# EAGLE schematic baseboard (EAGLE 6.5.0)
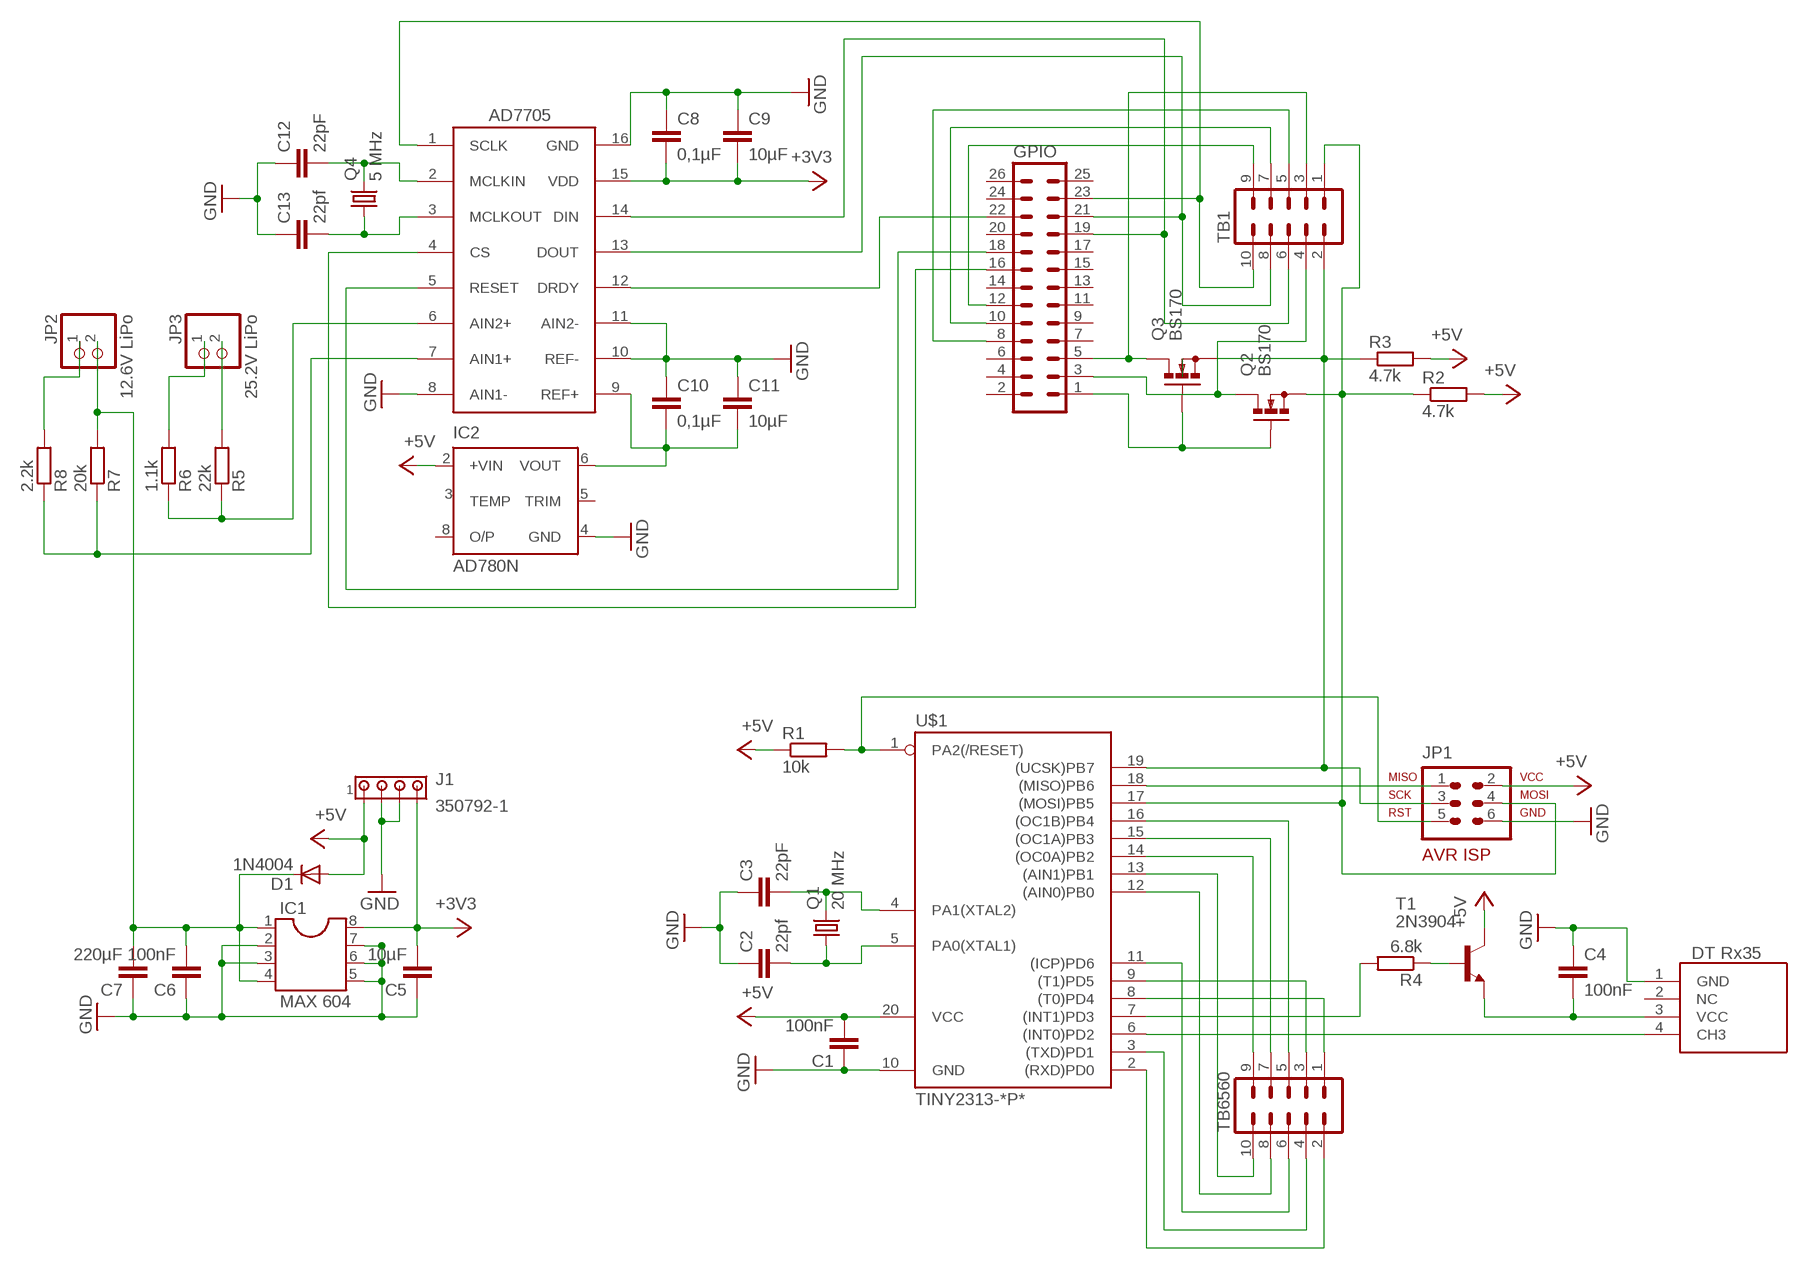
[diagram p0: schematic, sheet 1]

## Parts
C1  100nF  C2.5/2  [C2.5-2]
C2  22pf  C2.5/2  [C2.5-2]
C3  22pF  C2.5/2  [C2.5-2]
C4  100nF  C2.5/2  [C2.5-2]
C5  10µF  C2.5/2  [C2.5-2]
C6  100nF  C2.5/2  [C2.5-2]
C7  220µF  C2.5/2  [C2.5-2]
C8  0,1µF  C2.5/2  [C2.5-2]
C9  10µF  C2.5/2  [C2.5-2]
C10  0,1µF  C2.5/2  [C2.5-2]
C11  10µF  C2.5/2  [C2.5-2]
C12  22pF  C2.5/2  [C2.5-2]
C13  22pf  C2.5/2  [C2.5-2]
D1  1N4004  [DO41-10]
GPIO  ML26  [ML26]
IC1  MAX 604  DIL8  [DIL08]
IC2  AD780N  [DIL08]
J1  350792-1  [350792-1]
JP1  AVR-ISP-6VERT  [AVR-ISP-6]
JP2  12.6V LiPo  PINHD-1X2  [1X02]
JP3  25.2V LiPo  PINHD-1X2  [1X02]
Q1  20 MHz  CRYSTALHC49S  [HC49/S]
Q2  BS170  [SOT54E]
Q3  BS170  [SOT54E]
Q4  5 MHz  CRYSTALHC49S  [HC49/S]
R1  10k  R-EU_0207/2V  [0207/2V]
R2  4.7k  R-EU_0207/2V  [0207/2V]
R3  4.7k  R-EU_0207/2V  [0207/2V]
R4  6.8k  R-EU_0207/12  [0207/12]
R5  22k  R-EU_0207/2V  [0207/2V]
R6  1.1k  R-EU_0207/2V  [0207/2V]
R7  20k  R-EU_0207/2V  [0207/2V]
R8  2.2k  R-EU_0207/2V  [0207/2V]
T1  2N3904  [TO92]
TB1  ML10  [ML10]
TB6560  ML10  [ML10]
U$1  TINY2313-*P*  [DIL20]
U$2  DTRX35  [DTRX35]
U$3  AD7705  [AD7705BNC]

## Nets
+3V3: C5.2 C8.2 C9.2 IC1.8 J1.4 U$3.15(VDD)
+5V: C1.2 D1.A IC2.2(+VIN) J1.1 JP1.2 R1.1 R2.2 R3.2 T1.1(C) U$1.20(VCC)
GND: C1.1 C2.1 C3.1 C4.1 C5.1 C6.1 C7.1 C8.1 C9.1 C10.1 C11.1 C12.1 C13.1 IC1.2 IC1.3 IC1.5 IC1.6 IC1.7 IC2.4(GND) J1.2 J1.3 JP1.6 U$1.10(GND) U$2.1(GND) U$3.8(AIN1-) U$3.10(REF-) U$3.11(AIN2-) U$3.16(GND)
N$1: JP1.1 U$1.18((MISO)PB6)
N$2: GPIO.5 Q3.D TB1.3
N$4: GPIO.3 Q2.D TB1.4
N$5: GPIO.1 Q2.G Q3.G
N$6: TB6560.1 U$1.8((T0)PD4)
N$7: TB6560.3 U$1.9((T1)PD5)
N$8: TB6560.5 U$1.16((OC1B)PB4)
N$9: TB6560.7 U$1.15((OC1A)PB3)
N$10: TB6560.9 U$1.14((OC0A)PB2)
N$11: TB6560.10 U$1.13((AIN1)PB1)
N$12: TB6560.8 U$1.12((AIN0)PB0)
N$13: TB6560.6 U$1.11((ICP)PD6)
N$14: TB6560.4 U$1.3((TXD)PD1)
N$15: R4.1 T1.2(B)
N$16: JP1.4 Q2.S R2.1 TB1.1 U$1.17((MOSI)PB5)
N$17: C4.2 T1.3(E) U$2.3(VCC)
N$18: R4.2 U$1.7((INT1)PD3)
N$19: C3.2 Q1.2 U$1.4(PA1(XTAL2))
N$20: C2.2 Q1.1 U$1.5(PA0(XTAL1))
N$21: JP1.5 R1.2 U$1.1(PA2(/RESET))
N$22: U$1.6((INT0)PD2) U$2.4(CH3)
N$23: TB6560.2 U$1.2((RXD)PD0)
N$24: GPIO.12 TB1.9
N$25: GPIO.10 TB1.7
N$26: GPIO.8 TB1.5
N$27: GPIO.23 TB1.10 U$3.1(SCLK)
N$28: JP1.3 Q3.S R3.1 TB1.2 U$1.19((UCSK)PB7)
N$29: GPIO.21 TB1.8 U$3.13(DOUT)
N$30: GPIO.19 TB1.6 U$3.14(DIN)
N$31: C10.2 C11.2 IC2.6(VOUT) U$3.9(REF+)
N$32: C6.2 C7.2 D1.C IC1.1 IC1.4 JP2.2 R7.2
N$33: JP3.1 R6.2
N$34: JP2.1 R8.2
N$35: C12.2 Q4.2 U$3.2(MCLKIN)
N$36: C13.2 Q4.1 U$3.3(MCLKOUT)
N$37: R5.1 R6.1 U$3.6(AIN2+)
N$38: R7.1 R8.1 U$3.7(AIN1+)
N$39: JP3.2 R5.2
N$40: GPIO.22 U$3.12(DRDY)
N$41: GPIO.16 U$3.4(CS)
N$43: GPIO.18 U$3.5(RESET)
Unconnected: GPIO.2 GPIO.4 GPIO.6 GPIO.7 GPIO.9 GPIO.11 GPIO.13 GPIO.14 GPIO.15 GPIO.17 GPIO.20 GPIO.24 GPIO.25 GPIO.26 IC2.3(TEMP) IC2.5(TRIM) IC2.8(O/P) U$2.2(NC)

## Library data of the parts
C1-C13 = capacitor-wima:C: CAPACITOR naming: grid - package width
D1 = diode:1N4004: DIODE general purpose rectifier, 1 A
GPIO = con-ml:ML26: HARTING; OC_FARNELL: unknown; OC_NEWARK: unknown
IC1 = ic-package:DIL8: Dual In Line / Socket
IC2 = analog-devices:AD780: High Precision Reference 2.5V/3.0V Source: http://www.analog.com/UploadedFiles/Data_Sheets/AD780.pdf; MF: ALTERA CORPORATION; MPN: AD780ANZ; OC_FARNELL: 9605550; OC_NEWARK: 59K5478
J1 = con-amp:350792-1: Universal MATE-N-LOK .250" Centerline, 600 V, 19 - 36 A max Source: http://catalog.tycoelectronics.com/ .. ENG_CD_350792_R.pdf
JP1 = avr-7:AVR-ISP-6: AVR ISP-6 Serial Programming Header
JP2 JP3 = pinhead:PINHD-1X2: PIN HEADER
Q1 Q4 = crystal:CRYSTAL: CRYSTAL; OC_FARNELL: 1667008; OC_NEWARK: unknown
Q2 Q3 = transistor-small-signal:BS170: N-CHANNEL MOS FET
R1-R8 = resistor:R-EU_: RESISTOR, European symbol
T1 = transistor-npn:2N3904: NPN Transistor
TB1 TB6560 = con-ml:ML10: HARTING; OC_FARNELL: unknown; OC_NEWARK: unknown
U$1 = avr-7:TINY2313*: Atmel Tiny2313 2K Flash, 128 bytes EEPROM, 128 bytes RAM
U$2 = DTRX35:DTRX35
U$3 = AD7705:AD7705